# EAGLE board SzineszFeny_2mm_V12 (EAGLE 7.5.0), part 1 of 2
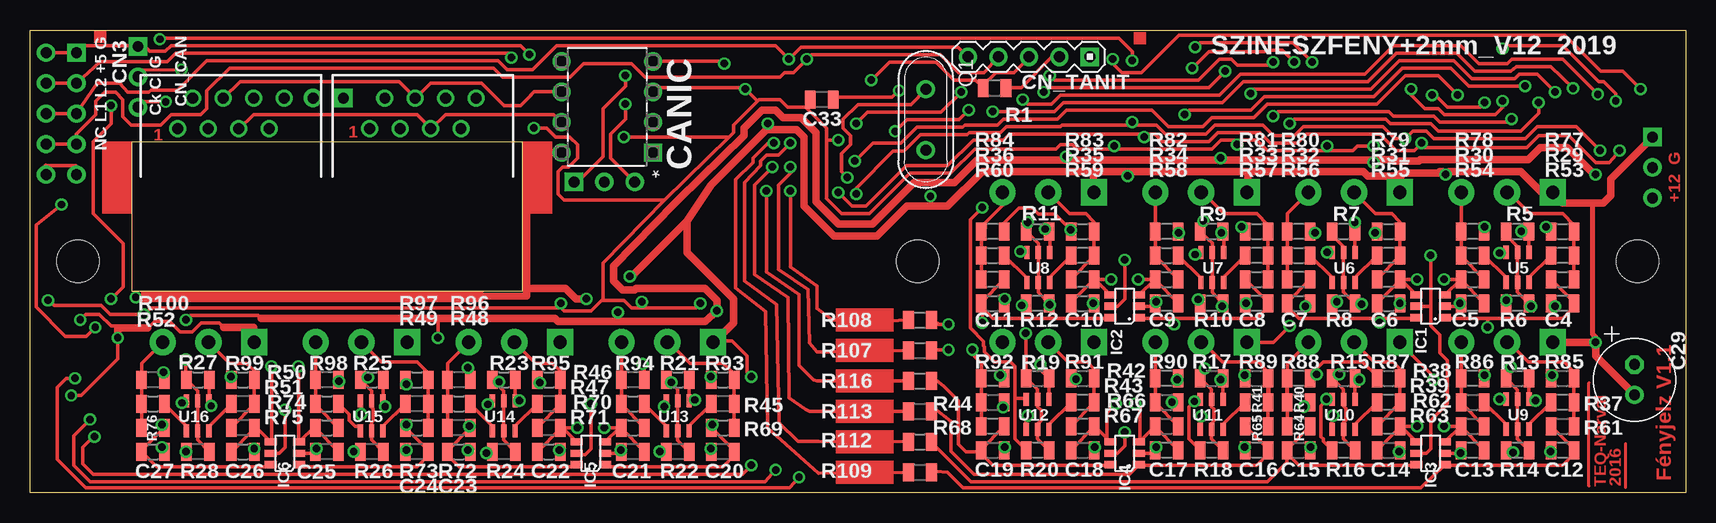
[diagram p2: board, top side]
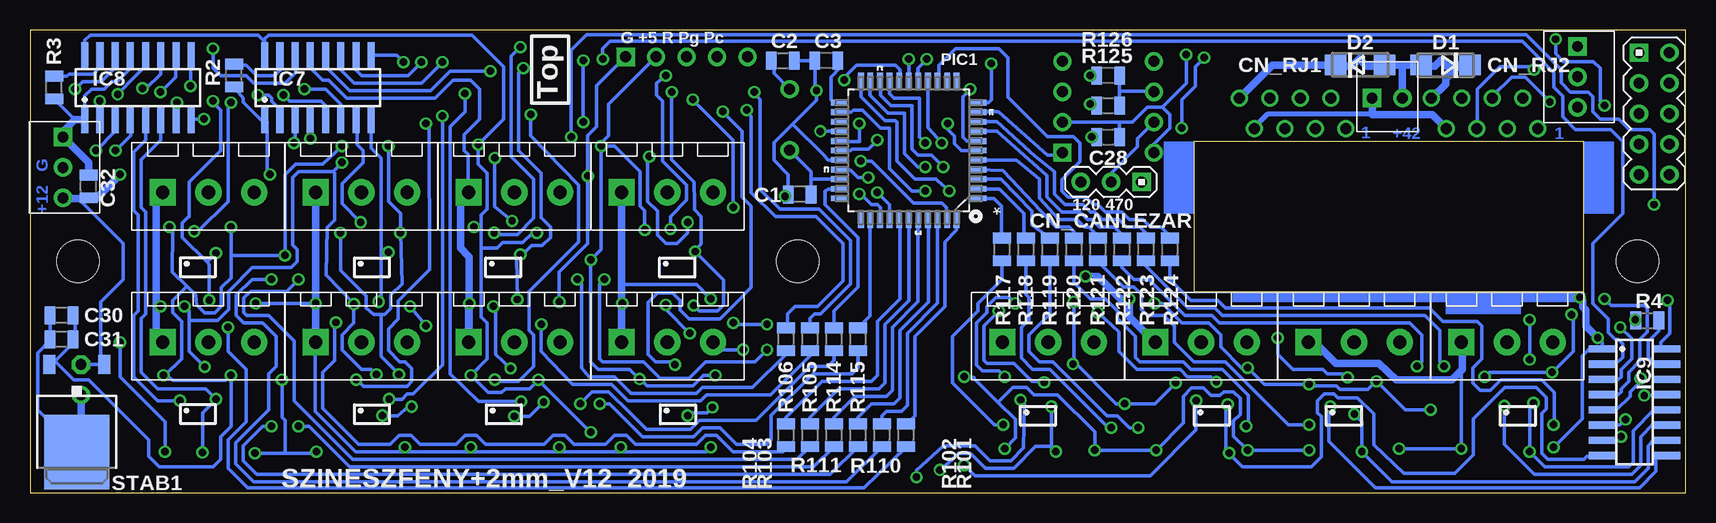
[diagram p3: board, bottom side, seen from below]

Size 138 x 38.6 mm. Coordinates in mm from the lower left corner, seen from the top.
Outline: 138,0 0,0 0,38.6 138,38.6 138,0
Outline: 8.5,29.3 41,29.3 41,16.8 8.5,16.8 8.5,29.3
Copper layers (1*16): Top 0.035mm / dielectric 1.5mm / Bottom 0.035mm
Design rules "default *": minimum track width 10mil, minimum drill 24mil, track to track 7mil, track to pad 7mil, pad to pad 7mil, via to via 7mil, smd to smd 0mil, copper to edge 7mil, drill to drill 8mil, minimum pad ring 10mil, minimum via ring 8mil, stop-mask expansion 4mil, vias tented up to drill 0mil, thermal gap 10mil
Net classes: 0 default: width 0.305 mm, clearance 0.178 mm; 1 Tap: width 0.406 mm, clearance 0.178 mm
Holes 3.5 mm at 74,19.3 134,19.3 4,19.3
tRestrict: area 70.5,15.8 to 77.5,22.8; area 130.5,15.8 to 137.5,22.8; area 0.5,15.8 to 7.5,22.8
bRestrict: area 70.5,15.8 to 77.5,22.8; area 130.5,15.8 to 137.5,22.8; area 0.5,15.8 to 7.5,22.8

## Footprints (pad centres in the part's own frame; a part is rotated, then mirrored left to right if it is on the bottom)
R0805 = smd 0.9 x 1.5: 1 -0.953,0; 2 0.953,0
C_EL1RASZT07 = drill 0.914 pad 1.524 octagon: P+ 1.27,0 | drill 0.914 pad 1.524: P- -1.27,0
DIP254P762X432-8 = drill 0.914 pad 1.524 square: 1 -3.81,3.81 | drill 0.914 pad 1.524: 2 -3.81,1.27; 3 -3.81,-1.27; 4 -3.81,-3.81; 5 3.81,-3.81; 6 3.81,-1.27; 7 3.81,1.27; 8 3.81,3.81
PIN05_2 = drill 0.914 pad 1.524 square: 1 -5.08,0 | drill 0.914 pad 1.524: 2 -5.08,2.54; 3 -2.54,0; 4 -2.54,2.54; 5 0,0; 6 0,2.54; 7 2.54,0; 8 2.54,2.54; 9 5.08,0; 10 5.08,2.54
PIN03_1 = drill 0.914 pad 1.524 square: 1 -2.54,0 | drill 0.914 pad 1.524: 2 0,0; 3 2.54,0
RJ45_CSAKPIN = drill 0.9 pad 1.4: 1 -4.445,3.81; 2 -3.175,6.35; 3 -1.905,3.81; 4 -0.635,6.35; 5 0.635,3.81; 6 1.905,6.35; 7 3.175,3.81; 8 4.445,6.35
PIN05_1 = drill 0.914 pad 1.524 square: 1 -5.08,0 | drill 0.914 pad 1.524: 2 -2.54,0; 3 0,0; 4 2.54,0; 5 5.08,0
DO214AC = smd 1.8 x 1.7: A 2.05,0; C -2.05,0
TSOP-6 = smd 0.6 x 1: 1 -0.95,-1.2; 2 0,-1.2; 3 0.95,-1.2; 4 0.95,1.2; 5 0,1.2; 6 -0.95,1.2
SO16 = smd 0.6 x 2.2: 1 -4.445,-2.695; 2 -3.175,-2.695; 3 -1.905,-2.695; 4 -0.635,-2.695; 5 0.635,-2.695; 6 1.905,-2.695; 7 3.175,-2.695; 8 4.445,-2.695; 9 4.445,2.695; 10 3.175,2.695; 11 1.905,2.695; 12 0.635,2.695; 13 -0.635,2.695; 14 -1.905,2.695; 15 -3.175,2.695; 16 -4.445,2.695
QFP80P1200X1200X120-44N = smd 1.473 x 0.483: 1 -5.74,3.988; 2 -5.74,3.2; 3 -5.74,2.388; 4 -5.74,1.6; 5 -5.74,0.787; 6 -5.74,0; 7 -5.74,-0.787; 8 -5.74,-1.6; 9 -5.74,-2.388; 10 -5.74,-3.2; 11 -5.74,-3.988; 23 5.74,-3.988; 24 5.74,-3.2; 25 5.74,-2.388; 26 5.74,-1.6; 27 5.74,-0.787; 28 5.74,0; 29 5.74,0.787; 30 5.74,1.6; 31 5.74,2.388; 32 5.74,3.2; 33 5.74,3.988 | smd 0.483 x 1.473: 12 -3.988,-5.74; 13 -3.2,-5.74; 14 -2.388,-5.74; 15 -1.6,-5.74; 16 -0.787,-5.74; 17 0,-5.74; 18 0.787,-5.74; 19 1.6,-5.74; 20 2.388,-5.74; 21 3.2,-5.74; 22 3.988,-5.74; 34 3.988,5.74; 35 3.2,5.74; 36 2.388,5.74; 37 1.6,5.74; 38 0.787,5.74; 39 0,5.74; 40 -0.787,5.74; 41 -1.6,5.74; 42 -2.388,5.74; 43 -3.2,5.74; 44 -3.988,5.74
XTAL_QS = drill 0.914 pad 1.524: 1 -2.54,0; 2 2.54,0
R0805@1 = smd 0.9 x 1.5: 1 -0.953,0; 2 0.953,0
TO252 = smd 1 x 1.6: 1 -2.28,-4.8; 2 2.28,-4.8 | smd 5.4 x 6.2: 3 0,2.5
SOT26 = smd 0.45 x 1.1: P$1 -0.95,-1.25; P$2 0,-1.25; P$3 0.95,-1.25; P$4 0.95,1.25; P$5 0,1.25; P$6 -0.95,1.25
FEHER_TUS_3 = drill 0.914 pad 1.524 square: P$1 0,0 | drill 0.914 pad 1.524: P$2 2.54,0; P$3 5.08,0
FEHER_TUS_2 = drill 0.914 pad 1.524 square: P$1 0,0 | drill 0.914 pad 1.524: P$2 2.54,0
ZOLD_KICSI_3P = drill 1.1 pad 2.184 square: 1 -3.81,-0.5 | drill 1.1 pad 2.184: 2 0,-0.5; 3 3.81,-0.5

## Placement (x,y rotation side)
C1  22  [R0805]  73.84,24.89 180 bottom
C2  22  [R0805]  75.25,36.05 0 bottom
C3  10u  [R0805]  71.62,36.05 180 bottom
C4  100n  [R0805]  127.75,15.8 180 top
C5  100n  [R0805]  120.25,15.8 180 top
C6  100n  [R0805]  113.25,15.8 0 top
C7  100n  [R0805]  105.75,15.8 0 top
C8  100n  [R0805]  102.25,15.8 180 top
C9  100n  [R0805]  94.75,15.8 180 top
C10  100n  [R0805]  87.75,15.8 0 top
C11  100n  [R0805]  80.25,15.8 0 top
C12  100n  [R0805]  127.75,3.55 180 top
C13  100n  [R0805]  120.25,3.55 180 top
C14  100n  [R0805]  113.25,3.55 0 top
C15  100n  [R0805]  105.75,3.55 0 top
C16  100n  [R0805]  102.25,3.55 180 top
C17  100n  [R0805]  94.75,3.55 180 top
C18  100n  [R0805]  87.75,3.55 0 top
C19  100n  [R0805]  80.25,3.55 0 top
C20  100n  [R0805]  57.75,3.42 180 top
C21  100n  [R0805]  50.25,3.42 180 top
C22  100n  [R0805]  43.25,3.42 0 top
C23  100n  [R0805]  35.75,3.42 0 top
C24  100n  [R0805]  32.25,3.42 180 top
C25  100n  [R0805]  24.75,3.42 180 top
C26  100n  [R0805]  17.75,3.42 0 top
C27  100n  [R0805]  10.25,3.42 0 top
C28  100n  [R0805]  48.12,29.68 0 bottom
C29  100u  [C_EL1RASZT07]  133.75,9.43 90 top
C30  10u  [R0805]  135.38,12.8 180 bottom
C31  100n  [R0805]  135.38,14.8 180 bottom
C32  100n  [R0805]  133.12,25.55 90 bottom
C33  100n  [R0805]  66,32.8 180 top
CANIC  MCP2551  [DIP254P762X432-8]  48.12,32.17 180 top
CN3  PIN05_2'THT'  [PIN05_2]  3.88,31.62 270 bottom
CN_CANLEZAR  PIN03_1  [PIN03_1]  47.88,25.93 180 bottom
CN_RJ1  RJ45_CSAKPIN  [RJ45_CSAKPIN]  32.75,26.55 0 top
CN_RJ2  RJ45_CSAKPIN  [RJ45_CSAKPIN]  16.75,26.55 0 top
CN_TANIT  PIN05_1  [PIN05_1]  83.27,36.36 180 top
D1  SS16  [DO214AC]  20,35.67 180 bottom
D2  SS16  [DO214AC]  27.12,35.67 0 bottom
IC1  BEM_VEDO  [TSOP-6]  116.75,15.55 90 top
IC2  BEM_VEDO  [TSOP-6]  91.25,15.55 90 top
IC3  BEM_VEDO  [TSOP-6]  116.75,3.3 90 top
IC4  BEM_VEDO  [TSOP-6]  91.25,3.3 90 top
IC5  BEM_VEDO  [TSOP-6]  46.75,3.3 90 top
IC6  BEM_VEDO  [TSOP-6]  21.25,3.3 90 top
IC7  SCT2168SOP16  [SO16]  114,33.8 0 bottom
IC8  SCT2168SOP16  [SO16]  129,33.8 0 bottom
IC9  SCT2168SOP16  [SO16]  4.25,7.55 270 bottom
PIC1  PIC18F45K80-I/PT  [QFP80P1200X1200X120-44N]  64.75,28.55 180 bottom
Q1  [XTAL_QS]  74.68,31.12 270 top
R1  2.2k  [R0805@1]  80.41,33.77 0 top
R2  470  [R0805@1]  121,34.8 90 bottom
R3  470  [R0805@1]  136,33.8 90 bottom
R4  470  [R0805@1]  3.19,14.36 0 bottom
R5  10k  [R0805@1]  124,21.81 0 top
R6  10k  [R0805@1]  124,15.8 180 top
R7  10k  [R0805@1]  109.49,21.81 0 top
R8  10k  [R0805@1]  109.5,15.8 180 top
R9  10k  [R0805@1]  98.49,21.81 0 top
R10  10k  [R0805@1]  98.5,15.8 180 top
R11  10k  [R0805@1]  84,21.8 0 top
R12  10k  [R0805@1]  84,15.8 180 top
R13  10k  [R0805@1]  124,9.55 0 top
R14  10k  [R0805@1]  124,3.55 180 top
R15  10k  [R0805@1]  109.5,9.55 0 top
R16  10k  [R0805@1]  109.5,3.55 180 top
R17  10k  [R0805@1]  98.5,9.55 0 top
R18  10k  [R0805@1]  98.5,3.55 180 top
R19  10k  [R0805@1]  84,9.55 0 top
R20  10k  [R0805@1]  84,3.55 180 top
R21  10k  [R0805@1]  54,9.43 0 top
R22  10k  [R0805@1]  54,3.42 180 top
R23  10k  [R0805@1]  39.5,9.43 0 top
R24  10k  [R0805@1]  39.5,3.42 180 top
R25  10k  [R0805@1]  28.5,9.43 0 top
R26  10k  [R0805@1]  28.5,3.42 180 top
R27  10k  [R0805@1]  14,9.43 0 top
R28  10k  [R0805@1]  14,3.42 180 top
R29  22  [R0805@1]  127.75,19.8 180 top
R30  22  [R0805@1]  120.25,19.8 0 top
R31  22  [R0805@1]  113.25,19.8 180 top
R32  22  [R0805@1]  105.75,19.8 0 top
R33  22  [R0805@1]  102.25,19.8 180 top
R34  22  [R0805@1]  94.75,19.8 0 top
R35  22  [R0805@1]  87.75,19.8 180 top
R36  22  [R0805@1]  80.25,19.8 0 top
R37  22  [R0805@1]  127.75,7.55 180 top
R38  22  [R0805@1]  120.25,7.55 0 top
R39  22  [R0805@1]  113.25,7.55 180 top
R40  22  [R0805@1]  105.75,7.55 0 top
R41  22  [R0805@1]  102.25,7.55 180 top
R42  22  [R0805@1]  94.75,7.55 0 top
R43  22  [R0805@1]  87.75,7.55 180 top
R44  22  [R0805@1]  80.25,7.55 0 top
R45  22  [R0805@1]  57.75,7.42 180 top
R46  22  [R0805@1]  50.25,7.42 0 top
R47  22  [R0805@1]  43.25,7.42 180 top
R48  22  [R0805@1]  35.75,7.42 0 top
R49  22  [R0805@1]  32.25,7.42 180 top
R50  22  [R0805@1]  24.75,7.42 0 top
R51  22  [R0805@1]  17.75,7.42 180 top
R52  22  [R0805@1]  10.25,7.42 0 top
R53  10k  [R0805@1]  127.75,17.8 0 top
R54  10k  [R0805@1]  120.25,17.8 0 top
R55  10k  [R0805@1]  113.25,17.8 180 top
R56  10k  [R0805@1]  105.75,17.8 180 top
R57  10k  [R0805@1]  102.25,17.8 0 top
R58  10k  [R0805@1]  94.75,17.8 0 top
R59  10k  [R0805@1]  87.75,17.8 180 top
R60  10k  [R0805@1]  80.25,17.8 180 top
R61  10k  [R0805@1]  127.75,5.55 0 top
R62  10k  [R0805@1]  120.25,5.55 0 top
R63  10k  [R0805@1]  113.25,5.55 180 top
R64  10k  [R0805@1]  105.75,5.55 180 top
R65  10k  [R0805@1]  102.25,5.55 0 top
R66  10k  [R0805@1]  94.75,5.55 0 top
R67  10k  [R0805@1]  87.75,5.55 180 top
R68  10k  [R0805@1]  80.25,5.55 180 top
R69  10k  [R0805@1]  57.75,5.42 0 top
R70  10k  [R0805@1]  50.25,5.42 0 top
R71  10k  [R0805@1]  43.25,5.42 180 top
R72  10k  [R0805@1]  35.75,5.42 180 top
R73  10k  [R0805@1]  32.25,5.42 0 top
R74  10k  [R0805@1]  24.75,5.42 0 top
R75  10k  [R0805@1]  17.75,5.42 180 top
R76  10k  [R0805@1]  10.25,5.42 180 top
R77  10k  [R0805@1]  127.75,21.8 0 top
R78  10k  [R0805@1]  120.25,21.8 180 top
R79  10k  [R0805@1]  113.25,21.8 0 top
R80  10k  [R0805@1]  105.75,21.8 180 top
R81  10jk  [R0805@1]  102.25,21.8 0 top
R82  10k  [R0805@1]  94.75,21.8 180 top
R83  10k  [R0805@1]  87.75,21.8 0 top
R84  10k  [R0805@1]  80.25,21.8 180 top
R85  10k  [R0805@1]  127.75,9.55 0 top
R86  10k  [R0805@1]  120.25,9.55 180 top
R87  10k  [R0805@1]  113.25,9.55 0 top
R88  10k  [R0805@1]  105.75,9.55 180 top
R89  10k  [R0805@1]  102.25,9.55 0 top
R90  10k  [R0805@1]  94.75,9.55 180 top
R91  10k  [R0805@1]  87.75,9.55 0 top
R92  10k  [R0805@1]  80.25,9.55 180 top
R93  10k  [R0805@1]  57.75,9.43 0 top
R94  10k  [R0805@1]  50.25,9.43 180 top
R95  10k  [R0805@1]  43.25,9.43 0 top
R96  10k  [R0805@1]  35.75,9.43 180 top
R97  10k  [R0805@1]  32.25,9.43 0 top
R98  10k  [R0805@1]  24.75,9.43 180 top
R99  10k  [R0805@1]  17.75,9.43 0 top
R100  10k  [R0805@1]  10.25,9.43 180 top
R101  10k  [R0805@1]  65,4.8 270 bottom
R102  10k  [R0805@1]  67,4.8 270 bottom
R103  10k  [R0805@1]  73,4.8 270 bottom
R104  10k  [R0805@1]  75,4.8 270 bottom
R105  10k  [R0805@1]  73,12.8 270 bottom
R106  10k  [R0805@1]  75,12.8 270 bottom
R107  10k  [R0805@1]  74.18,11.87 0 top
R108  10k  [R0805@1]  74.18,14.41 0 top
R109  10k  [R0805@1]  74.18,1.71 0 top
R110  10k  [R0805@1]  69,4.8 270 bottom
R111  10k  [R0805@1]  71,4.8 270 bottom
R112  10k  [R0805@1]  74.18,4.25 0 top
R113  10k  [R0805@1]  74.18,6.79 0 top
R114  10k  [R0805@1]  71,12.8 270 bottom
R115  10k  [R0805@1]  69,12.8 270 bottom
R116  10k  [R0805@1]  74.18,9.33 0 top
R117  10k  [R0805@1]  57,20.3 270 bottom
R118  10k  [R0805@1]  55,20.3 270 bottom
R119  10k  [R0805@1]  53,20.3 270 bottom
R120  10k  [R0805@1]  51,20.3 270 bottom
R121  10k  [R0805@1]  49,20.3 270 bottom
R122  10k  [R0805@1]  47,20.3 270 bottom
R123  10k  [R0805@1]  45,20.3 270 bottom
R124  10k  [R0805@1]  43,20.3 270 bottom
R125  470  [R0805@1]  48.12,34.8 180 bottom
R126  120  [R0805@1]  48.12,32.3 0 bottom
STAB1  7805DT  [TO252]  134.1,5.9 180 bottom
U5  FDC6306P  [SOT26]  124,18.8 180 top
U6  AP2625GY-HF-3SOT26  [SOT26]  109.49,18.8 180 top
U7  AP2625GY-HF-3SOT26  [SOT26]  98.55,18.8 180 top
U8  AP2625GY-HF-3SOT26  [SOT26]  84.05,18.79 180 top
U9  AP2625GY-HF-3SOT26  [SOT26]  124,6.55 180 top
U10  AP2625GY-HF-3SOT26  [SOT26]  109.49,6.55 180 top
U11  AP2625GY-HF-3SOT26  [SOT26]  98.49,6.55 180 top
U12  AP2625GY-HF-3SOT26  [SOT26]  83.99,6.54 180 top
U13  AP2625GY-HF-3SOT26  [SOT26]  53.99,6.41 180 top
U14  AP2625GY-HF-3SOT26  [SOT26]  39.48,6.41 180 top
U15  AP2625GY-HF-3SOT26  [SOT26]  28.48,6.41 180 top
U16  FDC6306P  [SOT26]  13.98,6.41 180 top
U$1  FEHER_TUS_3  [FEHER_TUS_3]  9,37.22 270 bottom
U$20  FEHER_TUS_3  [FEHER_TUS_3]  135.25,29.68 270 bottom
U$21  FEHER_TUS_2ALLO  [FEHER_TUS_2]  26.12,32.92 0 bottom
ZOLD_3P1  ZOLD_KICSI_3P  [ZOLD_KICSI_3P]  123.12,25.55 0 bottom
ZOLD_3P2  ZOLD_KICSI_3P  [ZOLD_KICSI_3P]  110.38,25.55 0 bottom
ZOLD_3P3  ZOLD_KICSI_3P  [ZOLD_KICSI_3P]  97.62,25.55 0 bottom
ZOLD_3P4  ZOLD_KICSI_3P  [ZOLD_KICSI_3P]  84.88,25.55 0 bottom
ZOLD_3P5  ZOLD_KICSI_3P  [ZOLD_KICSI_3P]  123.12,13.05 0 bottom
ZOLD_3P6  ZOLD_KICSI_3P  [ZOLD_KICSI_3P]  110.38,13.05 0 bottom
ZOLD_3P7  ZOLD_KICSI_3P  [ZOLD_KICSI_3P]  97.62,13.05 0 bottom
ZOLD_3P8  ZOLD_KICSI_3P  [ZOLD_KICSI_3P]  84.88,13.05 0 bottom
ZOLD_3P9  ZOLD_KICSI_3P  [ZOLD_KICSI_3P]  53.12,13.05 0 bottom
ZOLD_3P10  ZOLD_KICSI_3P  [ZOLD_KICSI_3P]  40.38,13.05 0 bottom
ZOLD_3P11  ZOLD_KICSI_3P  [ZOLD_KICSI_3P]  27.62,13.05 0 bottom
ZOLD_3P12  ZOLD_KICSI_3P  [ZOLD_KICSI_3P]  14.88,13.05 0 bottom